# EasyEDA schematic Etilen_Generator_Board-1.json
TITLE: Sheet_1; REV: 1.0; Date: 2024-07-24; Sheet: 1/1; Drawn By: ulirberdulham; Company: Your Company
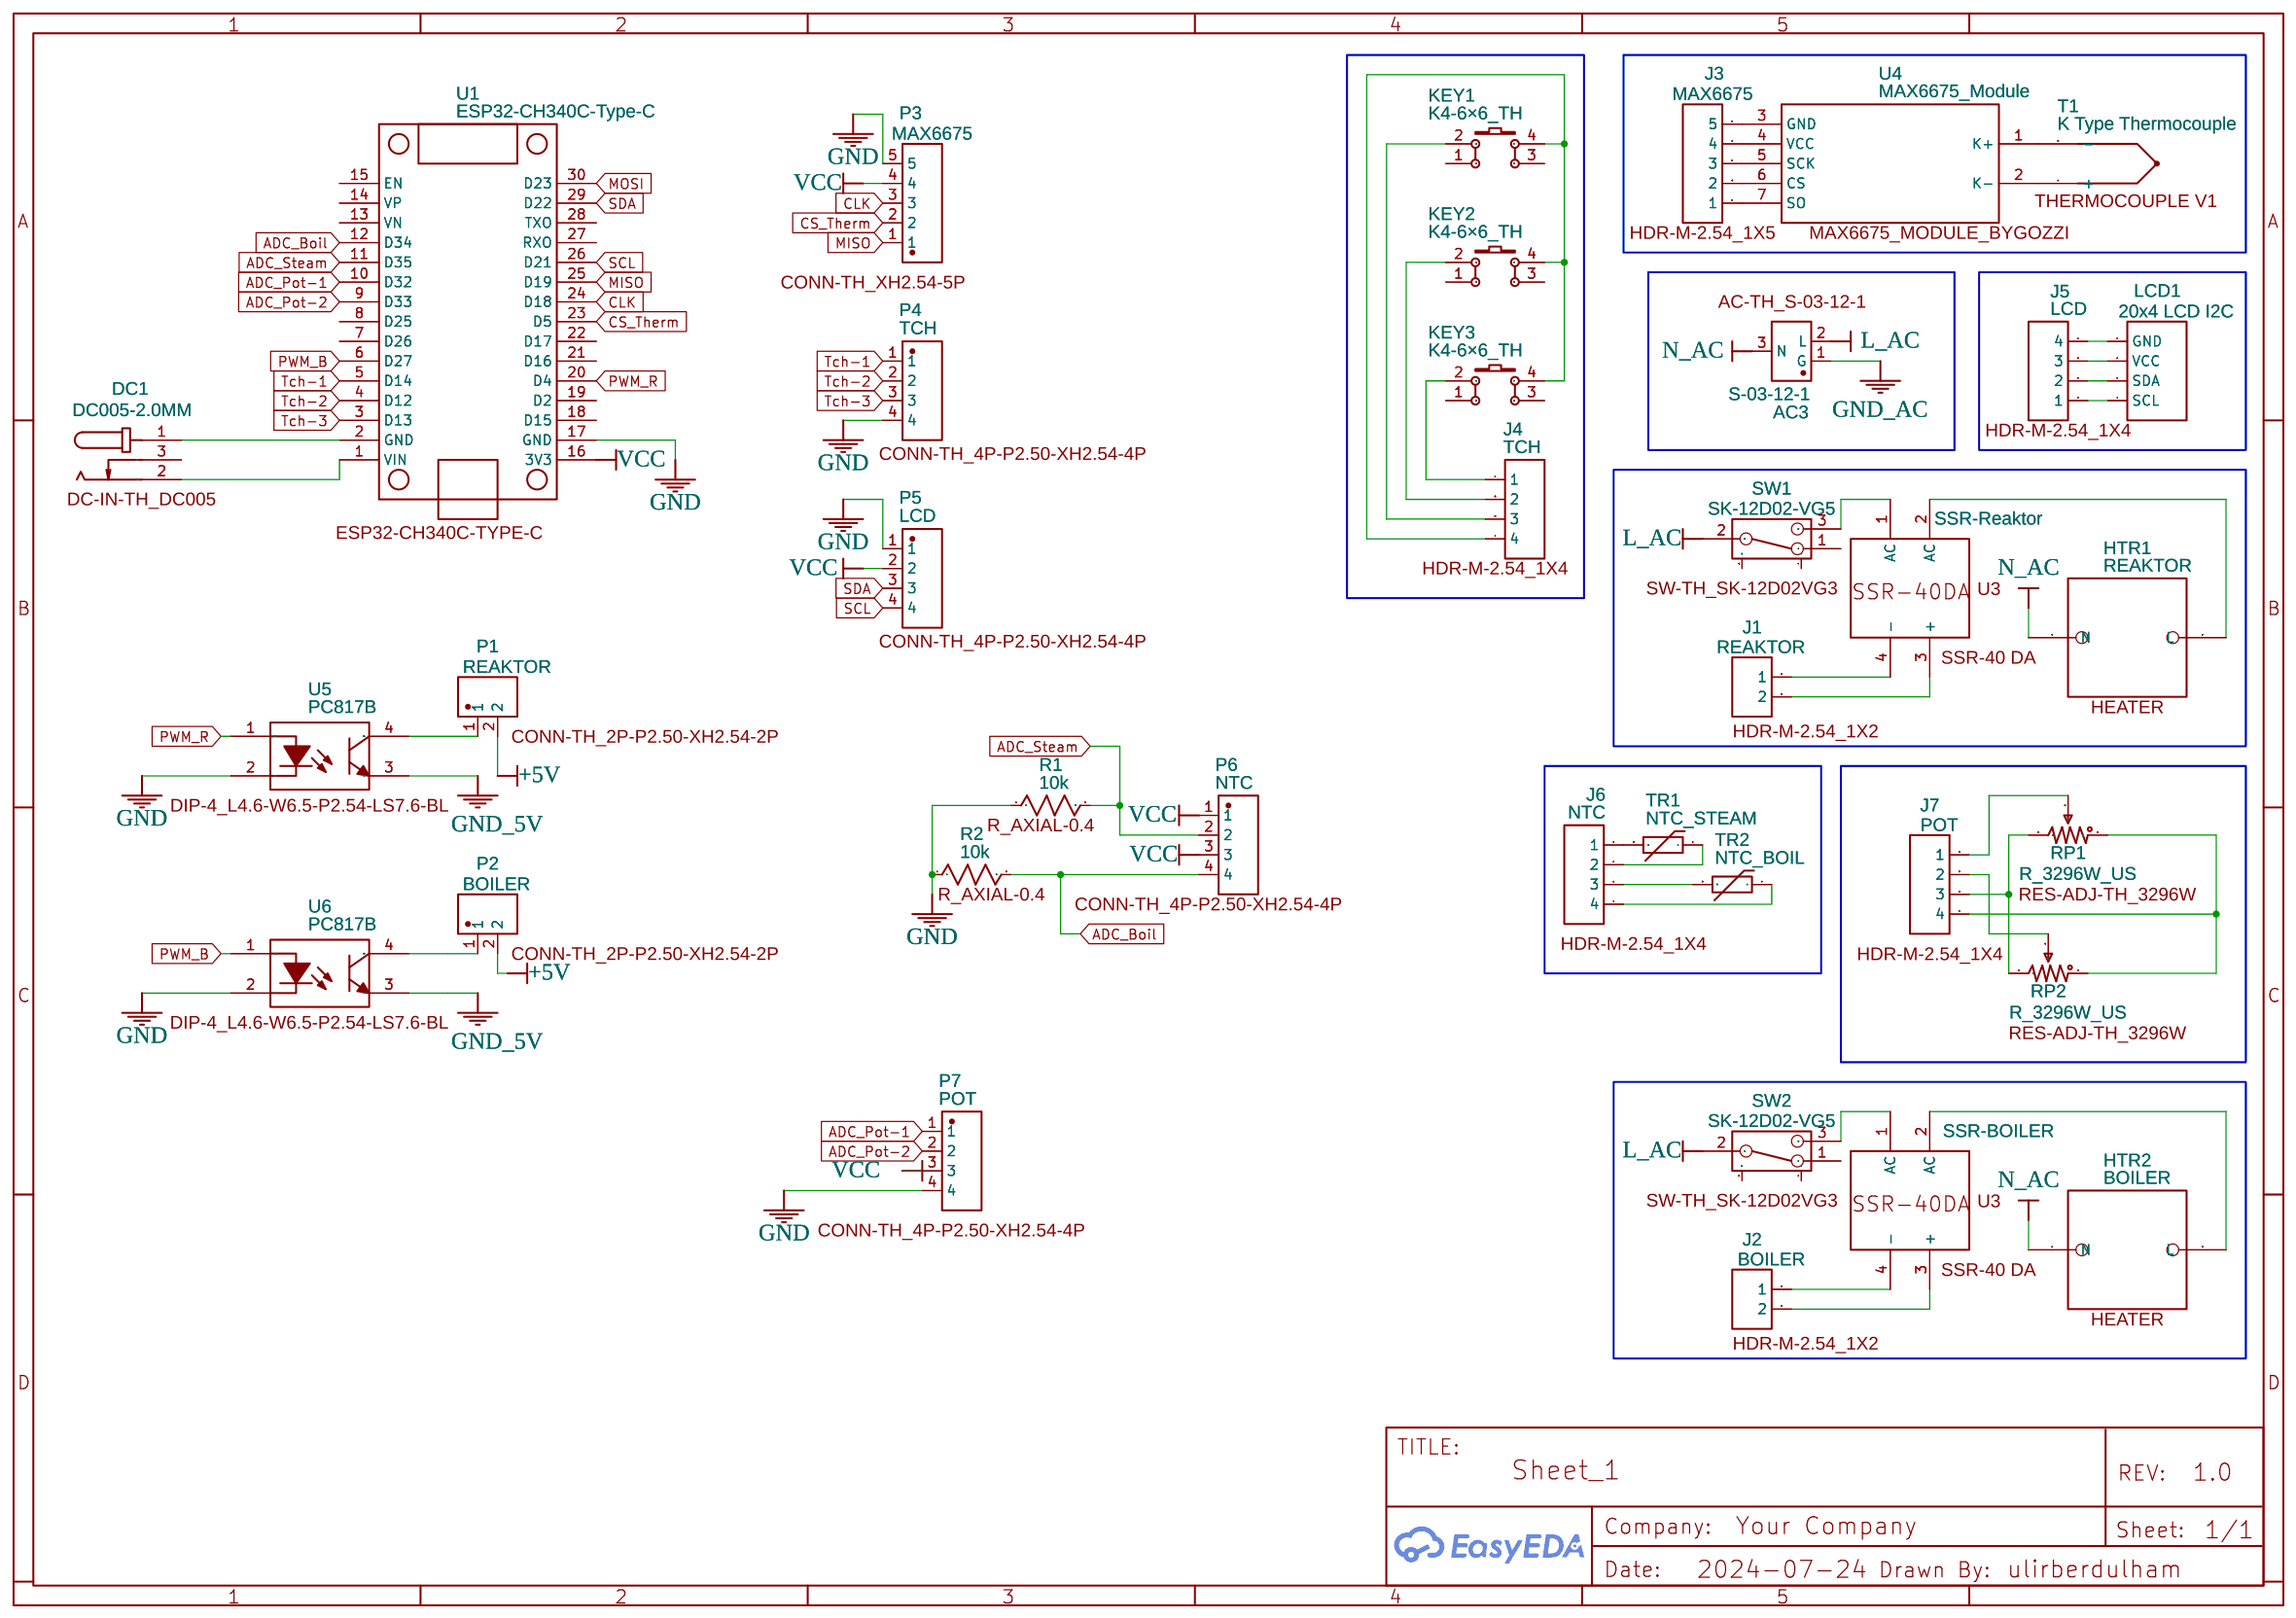
[diagram p0: schematic sheet]

## Parts
AC3  S-03-12-1  [AC-TH_S-03-12-1]
DC1  DC005-2.0MM  [DC-IN-TH_DC005]
HTR1  REAKTOR  [HEATER]
HTR2  BOILER  [HEATER]
J1  REAKTOR  [HDR-M-2.54_1X2]
J2  BOILER  [HDR-M-2.54_1X2]
J3  MAX6675  [HDR-M-2.54_1X5]
J4  TCH  [HDR-M-2.54_1X4]
J5  LCD  [HDR-M-2.54_1X4]
J6  NTC  [HDR-M-2.54_1X4]
J7  POT  [HDR-M-2.54_1X4]
KEY1  K4-6×6_TH  [KEY-TH_4P-L6.0-W6.0-P4.50-LS6.5]
KEY2  K4-6×6_TH  [KEY-TH_4P-L6.0-W6.0-P4.50-LS6.5]
KEY3  K4-6×6_TH  [KEY-TH_4P-L6.0-W6.0-P4.50-LS6.5]
LCD1  20x4 LCD I2C  [20X4 LCD WITH I2C]
P1  REAKTOR  [CONN-TH_2P-P2.50-XH2.54-2P]
P2  BOILER  [CONN-TH_2P-P2.50-XH2.54-2P]
P3  MAX6675  [CONN-TH_XH2.54-5P]
P4  TCH  [CONN-TH_4P-P2.50-XH2.54-4P]
P5  LCD  [CONN-TH_4P-P2.50-XH2.54-4P]
P6  NTC  [CONN-TH_4P-P2.50-XH2.54-4P]
P7  POT  [CONN-TH_4P-P2.50-XH2.54-4P]
R1  10k  [R_AXIAL-0.4]
R2  10k  [R_AXIAL-0.4]
RP1  R_3296W_US  [RES-ADJ-TH_3296W]
RP2  R_3296W_US  [RES-ADJ-TH_3296W]
SW1  SK-12D02-VG5  [SW-TH_SK-12D02VG3]
SW2  SK-12D02-VG5  [SW-TH_SK-12D02VG3]
T1  K Type Thermocouple  [THERMOCOUPLE V1]
TR1  NTC_STEAM  [RES-TH_L22.0-W7.0-P7.50-D1.0-S1.00]
TR2  NTC_BOIL  [RES-TH_L22.0-W7.0-P7.50-D1.0-S1.00]
U1  ESP32-CH340C-Type-C  [ESP32-CH340C-TYPE-C]
U2  SSR-BOILER  [SSR-40 DA]
U3  SSR-Reaktor  [SSR-40 DA]
U4  MAX6675_Module  [MAX6675_MODULE_BYGOZZI]
U5  PC817B  [DIP-4_L4.6-W6.5-P2.54-LS7.6-BL]
U6  PC817B  [DIP-4_L4.6-W6.5-P2.54-LS7.6-BL]

## Library data of the parts
AC3 = S-03-12-1: Contributor: danishjr.hd; Supplier: LCSC; Supplier Part: C268211; Manufacturer: HONGJU(宏聚); JLCPCB Part Class: Extended Part; Package Display: Yes
DC1 = DC005-2.0MM: Supplier: LCSC; Manufacturer: SOFNG; Supplier Part: C111567; Package Display: Yes
HTR1 HTR2 = HEATER: Contributor: Andrey Mikhailov; Package Display: Yes
J1 J2 = HDR-M-2.54_1x2: Supplier Part: C124375; Supplier: LCSC; Contributor: LCEDA_Lib; Package Display: Yes
J3 = HDR-M-2.54_1x5: Supplier Part: C358687; Supplier: LCSC; Contributor: LCEDA_Lib; Package Display: Yes
J4-J7 = HDR-M-2.54_1x4: Supplier Part: C124378; Supplier: LCSC; Contributor: LCEDA_Lib; Package Display: Yes
KEY1-KEY3 = K4-6×6_TH: Supplier: LCSC; Supplier Part: C136684; Manufacturer: 韩国韩荣; Manufacturer Part: K2-1102DP-E4SW-04; Contributor: LCEDA_Lib; Package Display: No
LCD1 = 20x4 LCD I2C: Supplier: LCSC; Manufacturer: ReliaPro; Manufacturer Part: Header-Female-2.54_1x4; Supplier Part: C124413; Contributor: rogerdebeer; Package Display: No
P1 P2 = XH-2P-2.54: Contributor: LCSC; Convert to PCB: Yes; Add into BOM: Yes; Supplier: LCSC; Supplier Part: C9900003929; Manufacturer: null; Package Display: Yes
P3 = XH-2.54-5P: Contributor: LCSC; Supplier: LCSC; Supplier Part: C9900003918; Manufacturer: null; Package Display: Yes
P4-P7 = XH-2.54-4P: Contributor: LCSC; Supplier: LCSC; Supplier Part: C9900003933; Manufacturer: null; Package Display: Yes
R1 R2 = R_AXIAL-0.4_US: Contributor: LCEDA_Lib; Package Display: Yes
RP1 RP2 = R_3296W_US: Supplier: LCSC; Contributor: LCEDA_Lib; value(Ω): 10K; Package Display: Yes
SW1 SW2 = SK-12D02-VG5: Supplier: LCSC; Supplier Part: C136722; Manufacturer: Rectangular Connectors - Contacts; Contributor: LCSC; Package Display: Yes
T1 = K Type Thermocouple: Supplier Part: 1568-1306-ND; Contributor: Сергей Трепуз; Package Display: Yes
TR1 TR2 = NTCTHERMISTOR: Supplier: LCSC; Manufacturer: RUILON; Manufacturer Part: NTCThermistor; Supplier Part: C42975; JLCPCB Part Class: Extended Part; Package Display: No
U1 = ESP32-CH340C-Type-C: Contributor: notan206; Package Display: Yes
U2 U3 = SSR-40 DA: Manufacturer: FOTEK; Contributor: Viktor96; Package Display: Yes
U4 = MAX6675_Module: Contributor: haykaz; Package Display: Yes
U5 U6 = PC817B: Contributor: LCSC; Supplier: LCSC; Supplier Part: C115499; Manufacturer: 华润华晶; JLCPCB Part Class: Extended Part; Package Display: Yes

## Nets
+5V: P1.2 P2.2
GND: P3.5 P4.4 P5.1 P7.4 R1.1 R2.1 U1.17(GND) U5.2(CAT) U6.2(CAT)
GND_5V: U5.3(EM) U6.3(EM)
GND_AC: AC3.1(G)
VCC: P3.4 P5.2 P6.1 P6.3 P7.3 U1.16(3V3)
ADC_Boil: P6.4 R2.2 U1.12(D34)
ADC_Pot-1: P7.1 U1.10(D32)
ADC_Pot-2: P7.2 U1.9(D33)
ADC_Steam: P6.2 R1.2 U1.11(D35)
CLK: P3.3 U1.24(D18)
CS_Therm: P3.2 U1.23(D5)
L_AC: AC3.2(L) SW1.2 SW2.2
MISO: P3.1 U1.25(D19)
MOSI: U1.30(D23)
N_AC: AC3.3(N) HTR1.1(N) HTR2.1(N)
PWM_B: U1.6(D27) U6.1(AN)
PWM_R: U1.20(D4) U5.1(AN)
SCL: P5.4 U1.26(D21)
SDA: P5.3 U1.29(D22)
Tch-1: P4.1 U1.5(D14)
Tch-2: P4.2 U1.4(D12)
Tch-3: P4.3 U1.3(D13)
Net-(DC1-1): DC1.1 U1.2(GND)
Net-(DC1-2): DC1.2 U1.1(VIN)
Net-(HTR1-2): HTR1.2(L) U3.2(AC)
Net-(HTR2-2): HTR2.2(L) U2.2(AC)
Net-(J1-1): J1.1 U3.4(-)
Net-(J1-2): J1.2 U3.3(+)
Net-(J2-1): J2.1 U2.4(-)
Net-(J2-2): J2.2 U2.3(+)
Net-(J3-1): J3.1 U4.7(SO)
Net-(J3-2): J3.2 U4.6(CS)
Net-(J3-3): J3.3 U4.5(SCK)
Net-(J3-4): J3.4 U4.4(VCC)
Net-(J3-5): J3.5 U4.3(GND)
Net-(J4-1): J4.1 KEY3.2
Net-(J4-2): J4.2 KEY2.2
Net-(J4-3): J4.3 KEY1.2
Net-(J4-4): J4.4 KEY1.4 KEY2.4 KEY3.4
Net-(J5-1): J5.1 LCD1.4(SCL)
Net-(J5-2): J5.2 LCD1.3(SDA)
Net-(J5-3): J5.3 LCD1.2(VCC)
Net-(J5-4): J5.4 LCD1.1(GND)
Net-(J6-1): J6.1 TR1.2
Net-(J6-2): J6.2 TR1.1
Net-(J6-3): J6.3 TR2.2
Net-(J6-4): J6.4 TR2.1
Net-(J7-1): J7.1 RP1.2
Net-(J7-2): J7.2 RP2.2
Net-(J7-3): J7.3 RP1.3 RP2.3
Net-(J7-4): J7.4 RP1.1 RP2.1
Net-(P1-1): P1.1 U5.4(COL)
Net-(P2-1): P2.1 U6.4(COL)
Net-(SW1-3): SW1.3 U3.1(AC)
Net-(SW2-3): SW2.3 U2.1(AC)
Net-(T1-1): T1.1(+) U4.2(K-)
Net-(T1-2): T1.2(-) U4.1(K+)

Not connected (* = marked no-connect by the designer): DC1 3; KEY1 1 3; KEY2 1 3; KEY3 1 3; SW1 1 4 5; SW2 1 4 5; U1 7(D26) 8(D25) 13(VN) 14(VP) 15(EN) 18(D15) 19(D2) 21(D16) 22(D17) 27(RXO) 28(TXO)
